# Altium schematic sheet USB-UART-Converter.SchDoc (part 3 of 3)
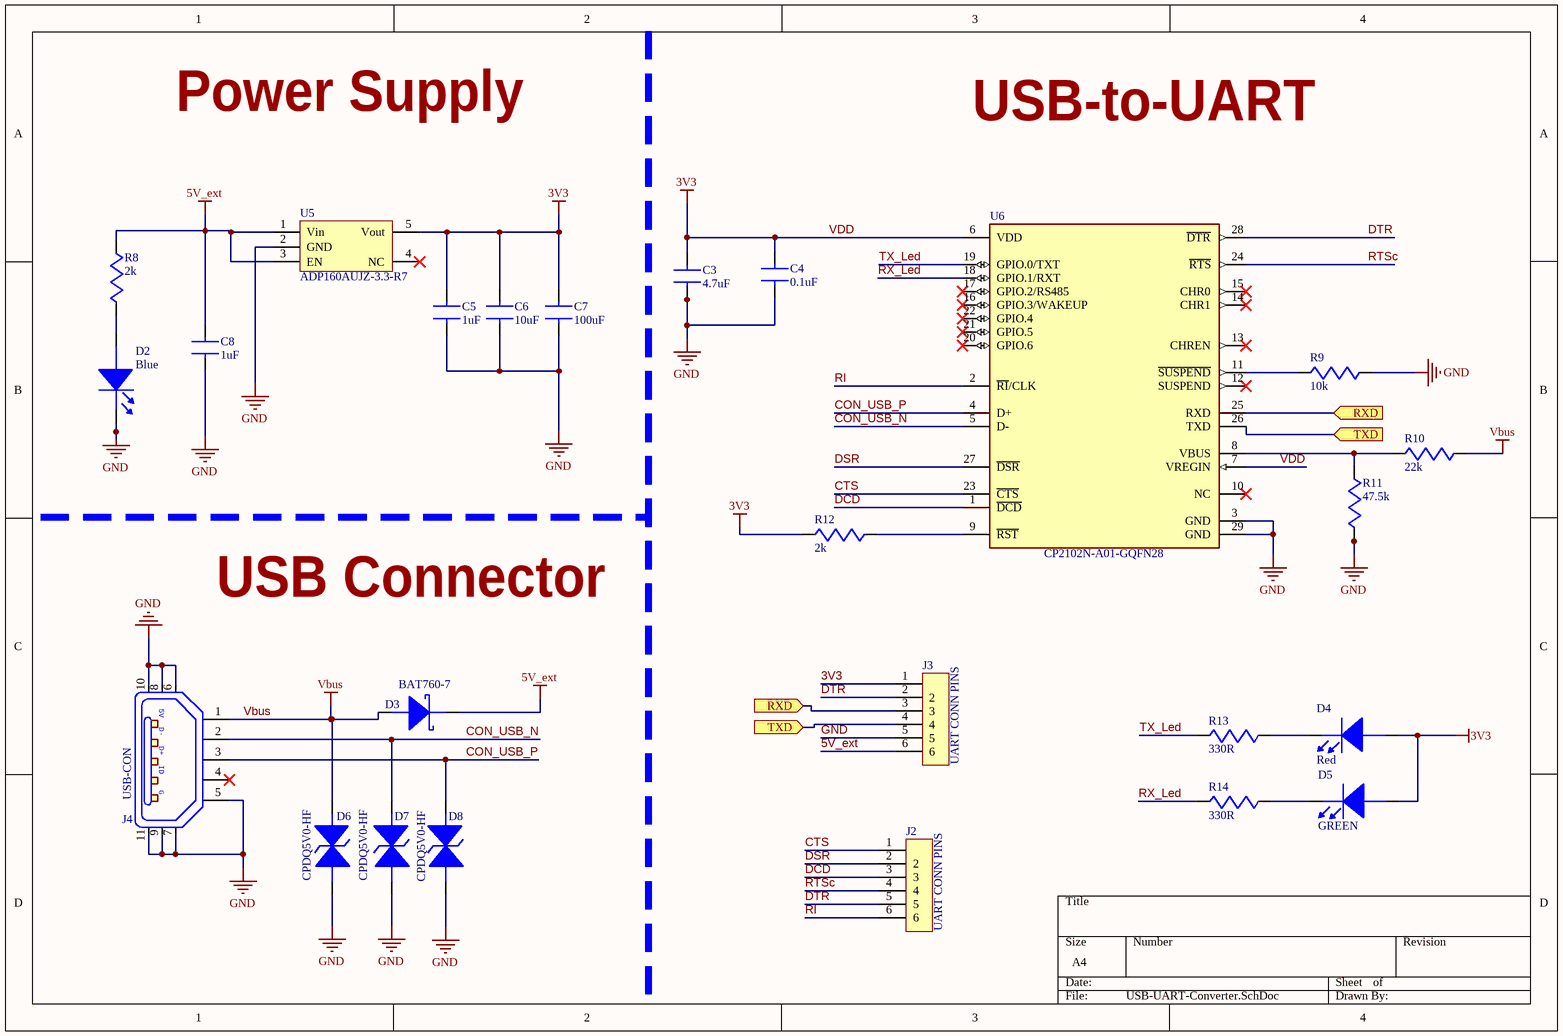
[diagram p2: USB-UART-Converter.SchDoc]

## Library data of the parts (continued)
U6 = CP2102N-A01-GQFN28: IC BRIDGE USB TO UART 28QFN; Manufacturer: Silicon Labs; Min Supply Voltage: 3V; Max Supply Voltage: 3.6V; Supplier 1: Digi-Key; Supplier Part Number 1: 336-3694-ND; Manufacturer Part Number: CP2102N-A01-GQFN28; RoHS: No; Category: USB Interface ICs; Case/Package: QFN; Number of Pins: 28; Min Operating Temperature: -40°C; Max Operating Temperature: 85°C; REACH SVHC: Unknown; ComponentLink1URL: http://www.farnell.com/datasheets/2245279.pdf?src-supplier=Farnell; ComponentLink1Description: http://www.farnell.com/datasheets/2245279.pdf?src-supplier=Farnell; ComponentLink2URL: http://www.silabs.com/documents/public/data-sheets/cp2102n-datasheet.pdf?src-supplier=Arrow+Electronics; ComponentLink2Description: http://www.silabs.com/documents/public/data-sheets/cp2102n-datasheet.pdf?src-supplier=Arrow+Electronics; ComponentLink3URL: https://www.silabs.com/documents/public/data-sheets/cp2102n-datasheet.pdf?src-supplier=Digi-Key; ComponentLink3Description: https://www.silabs.com/documents/public/data-sheets/cp2102n-datasheet.pdf?src-supplier=Digi-Key; ComponentLink4URL: http://www.farnell.com/datasheets/2060533.pdf?src-supplier=Element14; ComponentLink4Description: http://www.farnell.com/datasheets/2060533.pdf?src-supplier=Element14; ComponentLink5URL: http://www.silabs.com/documents/public/data-sheets/cp2102n-datasheet.pdf?src-supplier=Verical; ComponentLink5Description: http://www.silabs.com/documents/public/data-sheets/cp2102n-datasheet.pdf?src-supplier=Verical; ComponentLink6URL: http://www.silabs.com/documents/public/data-sheets/cp2102n-datasheet.pdf?src-supplier=Mouser; ComponentLink6Description: http://www.silabs.com/documents/public/data-sheets/cp2102n-datasheet.pdf?src-supplier=Mouser; ComponentLink7URL: http://www.silabs.com/documents/public/data-sheets/cp2102n-datasheet.pdf?src-supplier=Symmetry+Electronics; ComponentLink7Description: http://www.silabs.com/documents/public/data-sheets/cp2102n-datasheet.pdf?src-supplier=Symmetry+Electronics